# EAGLE design HVPulser0_1 (EAGLE 8.2.2)
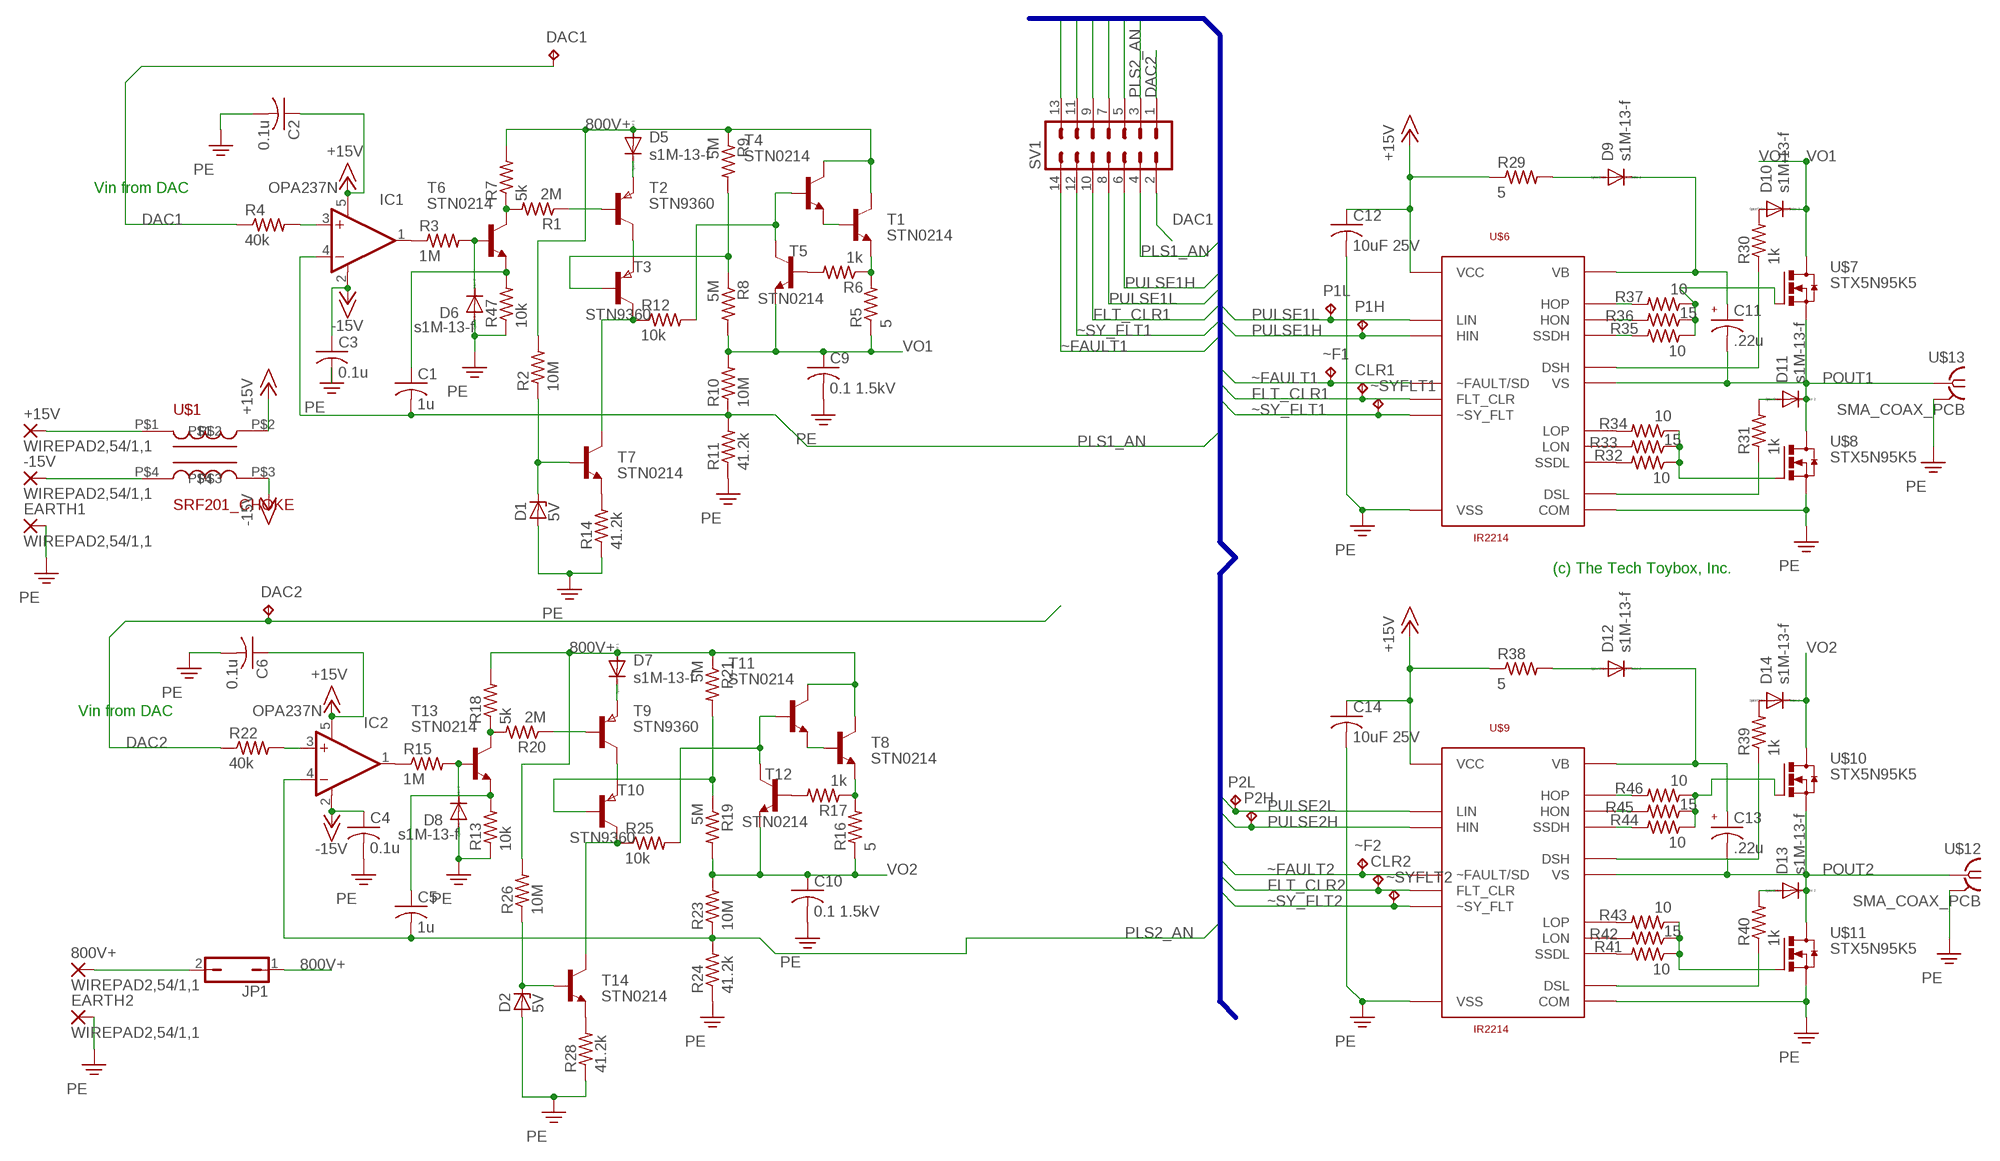
[diagram p0: schematic, sheet 1]

## Parts
800V+  WIREPAD2,54/1,1  [2,54/1,1]
+15V  WIREPAD2,54/1,1  [2,54/1,1]
-15V  WIREPAD2,54/1,1  [2,54/1,1]
C1  1u  C-USC0805  [C0805]
C2  0.1u  C-USC0805  [C0805]
C3  0.1u  C-USC0805  [C0805]
C4  0.1u  C-USC0805  [C0805]
C5  1u  C-USC0805  [C0805]
C6  0.1u  C-USC0805  [C0805]
C9  0.1 1.5kV  C-USC2225K  [C2225K]
C10  0.1 1.5kV  C-USC2225K  [C2225K]
C11  .22u  C-US050-035X075  [C050-035X075]
C12  10uF 25V  C-USC0805  [C0805]
C13  .22u  C-US050-035X075  [C050-035X075]
C14  10uF 25V  C-USC0805  [C0805]
CLR1  TPTP10R  [TP10R]
CLR2  TPTP10R  [TP10R]
D1  5V  ZENER-DIODEDO41Z10  [DO41Z10]
D2  5V  ZENER-DIODEDO41Z10  [DO41Z10]
D5  s1M-13-f  DIODE-DO214AC  [DO214AC]
D6  s1M-13-f  DIODE-DO214AC  [DO214AC]
D7  s1M-13-f  DIODE-DO214AC  [DO214AC]
D8  s1M-13-f  DIODE-DO214AC  [DO214AC]
D9  s1M-13-f  DIODE-DO214AC  [DO214AC]
D10  s1M-13-f  DIODE-DO214AC  [DO214AC]
D11  s1M-13-f  DIODE-DO214AC  [DO214AC]
D12  s1M-13-f  DIODE-DO214AC  [DO214AC]
D13  s1M-13-f  DIODE-DO214AC  [DO214AC]
D14  s1M-13-f  DIODE-DO214AC  [DO214AC]
DAC1  TPTP10R  [TP10R]
DAC2  TPTP10R  [TP10R]
EARTH1  WIREPAD2,54/1,1  [2,54/1,1]
EARTH2  WIREPAD2,54/1,1  [2,54/1,1]
IC1  OPA237N  [SOT23-5]
IC2  OPA237N  [SOT23-5]
JP1  JP1Q  [JP1]
P1H  TPTP10R  [TP10R]
P1L  TPTP10R  [TP10R]
P2H  TPTP10R  [TP10R]
P2L  TPTP10R  [TP10R]
R1  2M  R-US_0613/15  [P0613/15]
R2  10M  R-US_0613/15  [P0613/15]
R3  1M  R-US_R0603  [R0603]
R4  40k  R-US_R0603  [R0603]
R5  5  R-US_0613/15  [P0613/15]
R6  1k  R-US_0613/15  [P0613/15]
R7  5k  R-US_R0603  [R0603]
R8  5M  R-US_0613/15  [P0613/15]
R9  5M  R-US_0613/15  [P0613/15]
R10  10M  R-US_0613/15  [P0613/15]
R11  41.2k  R-US_0613/15  [P0613/15]
R12  10k  R-US_R0603  [R0603]
R13  10k  R-US_R0805  [R0805]
R14  41.2k  R-US_0613/15  [P0613/15]
R15  1M  R-US_R0603  [R0603]
R16  5  R-US_0613/15  [P0613/15]
R17  1k  R-US_0613/15  [P0613/15]
R18  5k  R-US_R0603  [R0603]
R19  5M  R-US_0613/15  [P0613/15]
R20  2M  R-US_0613/15  [P0613/15]
R21  5M  R-US_0613/15  [P0613/15]
R22  40k  R-US_R0603  [R0603]
R23  10M  R-US_0613/15  [P0613/15]
R24  41.2k  R-US_0613/15  [P0613/15]
R25  10k  R-US_R0603  [R0603]
R26  10M  R-US_0613/15  [P0613/15]
R28  41.2k  R-US_0613/15  [P0613/15]
R29  5  R-US_0207/10  [0207/10]
R30  1k  R-US_R0603  [R0603]
R31  1k  R-US_R0603  [R0603]
R32  10  R-US_R0805  [R0805]
R33  15  R-US_R0805  [R0805]
R34  10  R-US_R0805  [R0805]
R35  10  R-US_R0805  [R0805]
R36  15  R-US_R0805  [R0805]
R37  10  R-US_R0805  [R0805]
R38  5  R-US_0207/10  [0207/10]
R39  1k  R-US_R0603  [R0603]
R40  1k  R-US_R0603  [R0603]
R41  10  R-US_R0805  [R0805]
R42  15  R-US_R0805  [R0805]
R43  10  R-US_R0805  [R0805]
R44  10  R-US_R0805  [R0805]
R45  15  R-US_R0805  [R0805]
R46  10  R-US_R0805  [R0805]
R47  10k  R-US_R0805  [R0805]
SV1  MA07-2  [MA07-2]
T1  STN0214  -NPN-SOT223  [SOT223]
T2  STN9360  PNPSOT223  [SOT223]
T3  STN9360  PNPSOT223  [SOT223]
T4  STN0214  -NPN-SOT223  [SOT223]
T5  STN0214  -NPN-SOT223  [SOT223]
T6  STN0214  -NPN-SOT223  [SOT223]
T7  STN0214  -NPN-SOT223  [SOT223]
T8  STN0214  -NPN-SOT223  [SOT223]
T9  STN9360  PNPSOT223  [SOT223]
T10  STN9360  PNPSOT223  [SOT223]
T11  STN0214  -NPN-SOT223  [SOT223]
T12  STN0214  -NPN-SOT223  [SOT223]
T13  STN0214  -NPN-SOT223  [SOT223]
T14  STN0214  -NPN-SOT223  [SOT223]
U$1  SRF201_CHOKE  [CHOKE_BOURNES_SRF2012]
U$6  IR2214  [SSOP24-IR-0.65]
U$7  STX5N95K5  [TO220AV]
U$8  STX5N95K5  [TO220AV]
U$9  IR2214  [SSOP24-IR-0.65]
U$10  STX5N95K5  [TO220AV]
U$11  STX5N95K5  [TO220AV]
U$12  SMA_COAX_PCB  [SMA-COAX-V-TECONNECT]
U$13  SMA_COAX_PCB  [SMA-COAX-V-TECONNECT]
~F1  TPTP10R  [TP10R]
~F2  TPTP10R  [TP10R]
~SYFLT1  TPTP10R  [TP10R]
~SYFLT2  TPTP10R  [TP10R]

## Nets
800V+: D5.A D7.A JP1.1 R2.2 R7.2 R9.1 R18.2 R21.1 R26.2 T1.4(C) T4.4(C) T8.4(C) T11.4(C)
+15V: C2.1 C6.1 C12.1 C14.1 IC1.5(V+) IC2.5(V+) R29.1 R38.1 U$1.P$2 U$6.P$11(VCC) U$9.P$11(VCC)
+800VIN: 800V+.1(P) JP1.2
-15V: C3.1 C4.1 IC1.2(V-) IC2.2(V-) U$1.P$3
DAC1: DAC1.TP R4.1 SV1.2
DAC2: DAC2.TP R22.1 SV1.1
FLT_CLR1: CLR1.TP SV1.10 U$6.P$3(FLT_CLR)
FLT_CLR2: CLR2.TP SV1.9 U$9.P$3(FLT_CLR)
N$1: -15V.1(P) U$1.P$4
N$2: +15V.1(P) U$1.P$1
N$3: C1.1 R47.2 T6.3(E)
N$4: C5.1 R13.2 T13.3(E)
N$11: D9.A R29.2
N$12: R31.1 U$6.P$12(DSL)
N$13: D11.A R31.2
N$14: R32.1 R33.1 R34.1 U$8.1(G)
N$15: R35.1 R36.1 R37.1 U$7.1(G)
N$16: R30.1 U$6.P$24(DSH)
N$17: D10.A R30.2
N$18: D12.A R38.2
N$19: R41.2 U$9.P$7(SSDL)
N$20: R42.2 U$9.P$9(LON)
N$21: R43.2 U$9.P$10(LOP)
N$22: IC1.1(OUT) R3.1
N$23: T2.2(C) T2.4(C) T3.3(E)
N$24: R1.1 T2.1(B)
N$25: D5.C T2.3(E)
N$26: D6.C R3.2 T6.1(B)
N$27: IC1.3(+IN) R4.2
N$28: R40.1 U$9.P$12(DSL)
N$29: R5.2 R6.1 T1.3(E)
N$30: T1.1(B) T4.3(E)
N$31: R12.2 T4.1(B) T5.4(C)
N$32: R6.2 T5.1(B)
N$33: R8.1 R9.2 T3.1(B)
N$34: R1.2 R7.1 T6.4(C)
N$35: R12.1 T3.2(C) T3.4(C) T7.4(C)
N$36: R14.2 T7.3(E)
N$37: IC2.1(OUT) R15.1
N$38: D1.C R2.1 T7.1(B)
N$39: T9.2(C) T9.4(C) T10.3(E)
N$40: R16.2 R17.1 T8.3(E)
N$41: T8.1(B) T11.3(E)
N$42: R17.2 T12.1(B)
N$43: R19.1 R21.2 T10.1(B)
N$44: R20.1 T9.1(B)
N$45: D7.C T9.3(E)
N$46: R25.2 T11.1(B) T12.4(C)
N$47: D8.C R15.2 T13.1(B)
N$48: R18.1 R20.2 T13.4(C)
N$49: D13.A R40.2
N$50: IC2.3(+IN) R22.2
N$51: R25.1 T10.2(C) T10.4(C) T14.4(C)
N$52: R28.2 T14.3(E)
N$53: D2.C R26.1 T14.1(B)
N$54: R32.2 U$6.P$7(SSDL)
N$56: R33.2 U$6.P$9(LON)
N$58: R34.2 U$6.P$10(LOP)
N$64: R41.1 R42.1 R43.1 U$11.1(G)
N$69: R44.1 R45.1 R46.1 U$10.1(G)
N$82: R39.1 U$9.P$24(DSH)
N$83: D14.A R39.2
N$84: R46.2 U$9.P$21(HOP)
N$85: R45.2 U$9.P$20(HON)
N$87: R44.2 U$9.P$18(SSDH)
N$88: R37.2 U$6.P$21(HOP)
N$89: R36.2 U$6.P$20(HON)
N$90: R35.2 U$6.P$18(SSDH)
PE: C2.2 C3.2 C4.2 C6.2 C9.2 C10.2 C12.2 C14.2 D1.A D2.A D6.A D8.A EARTH1.1(P) EARTH2.1(P) R11.1 R13.1 R14.1 R24.1 R28.1 R47.1 U$6.P$6(VSS) U$6.P$8(COM) U$8.3(S) U$9.P$6(VSS) U$9.P$8(COM) U$11.3(S) U$12.2 U$12.3 U$12.4 U$12.5 U$13.2 U$13.3 U$13.4 U$13.5
PLS1_AN: C1.2 IC1.4(-IN) R10.1 R11.2 SV1.4
PLS2_AN: C5.2 IC2.4(-IN) R23.1 R24.2 SV1.3
POUT1: C11.2 D11.C U$6.P$19(VS) U$7.3(S) U$8.2(D) U$13.1
POUT2: C13.2 D13.C U$9.P$19(VS) U$10.3(S) U$11.2(D) U$12.1
PULSE1H: P1H.TP SV1.6 U$6.P$1(HIN)
PULSE1L: P1L.TP SV1.8 U$6.P$2(LIN)
PULSE2H: P2H.TP SV1.13 U$9.P$1(HIN)
PULSE2L: P2L.TP SV1.11 U$9.P$2(LIN)
VB3: C11.1 D9.C U$6.P$23(VB)
VB4: C13.1 D12.C U$9.P$23(VB)
VO1: C9.1 D10.C R5.1 R8.2 R10.2 T5.3(E) U$7.2(D)
VO2: C10.1 D14.C R16.1 R19.2 R23.2 T12.3(E) U$10.2(D)
~FAULT1: SV1.14 U$6.P$5(~FAULT/SD) ~F1.TP
~FAULT2: SV1.5 U$9.P$5(~FAULT/SD) ~F2.TP
~SY_FLT1: SV1.12 U$6.P$4(~SY_FLT) ~SYFLT1.TP
~SY_FLT2: SV1.7 U$9.P$4(~SY_FLT) ~SYFLT2.TP

## Buses
PULSE1H,PULSE1L,~FAULT1,~SY_FLT1,FLT_CLR1,PLS1_AN,PULSE2H,PULSE2L,~FAULT2,~SY_FLT2,FLT_CLR2,PLS2_AN,SCL,SDA,*LDAC1,RDY1,DBD_EN,DBD_PULSE,DBD_AN,MCLR,PGED,PGEC,USB_N,USB_P,VBUS,BUSB3V3,USBID,U2TX,U2RX,DET_PULSE,SD_WP,SD_CS,SD_SDI1,SD_SDO1,SD_SCK1,SD_CD,VDD,VSS

## Notes on the sheet
- Vin from DAC
- (c) The Tech Toybox, Inc.
- Vin from DAC

## Library data of the parts
800V+ +15V -15V EARTH1 EARTH2 = wirepad:WIREPAD: Wire PAD connect wire on PCB
C1-C6 C9 C10 C12 C14 = rcl:C-US: CAPACITOR, American symbol
C11 C13 = UserMark:C-US: CAPACITOR, American symbol; PARTNO: C1608X7R1H224K080AB
CLR1 CLR2 DAC1 DAC2 P1H P1L P2H P2L ~F1 ~F2 ~SYFLT1 ~SYFLT2 = testpad:TP: Test pad
D1 D2 = diode:ZENER-DIODE: Z-Diode
D5-D14 = diode:DIODE-: DIODE
IC1 IC2 = burr-brown:OPA237: Operational Amplifiers Single-Supply, MicroAmplifier(TM) Series; MF: TEXAS INSTRUMENTS; MPN: OPA237NA/250; OC_FARNELL: 4625298; OC_NEWARK: 35C1874
JP1 = jumper:JP1Q: JUMPER
R1-R26 R28-R47 = rcl:R-US_: RESISTOR, American symbol
SV1 = UserMark:MA07-2: PIN HEADER; OC_FARNELL: unknown; OC_NEWARK: unknown
T1 T4-T8 T11-T14 = transistor-neu-to92:*-NPN-: NPN Transistror
T2 T3 T9 T10 = zetex:PNPSOT223: PNP TRANSISTOR; MPN: DJT4030P-13; OC_FARNELL: 1710675; OC_NEWARK: 25R4489
U$1 = UserMark:SRF201_CHOKE
U$6 U$9 = UserMark:IR2214
U$7 U$8 U$10 U$11 = UserMark:STX5N95K5
U$12 U$13 = UserMark:SMA_COAX_PCB

## Board
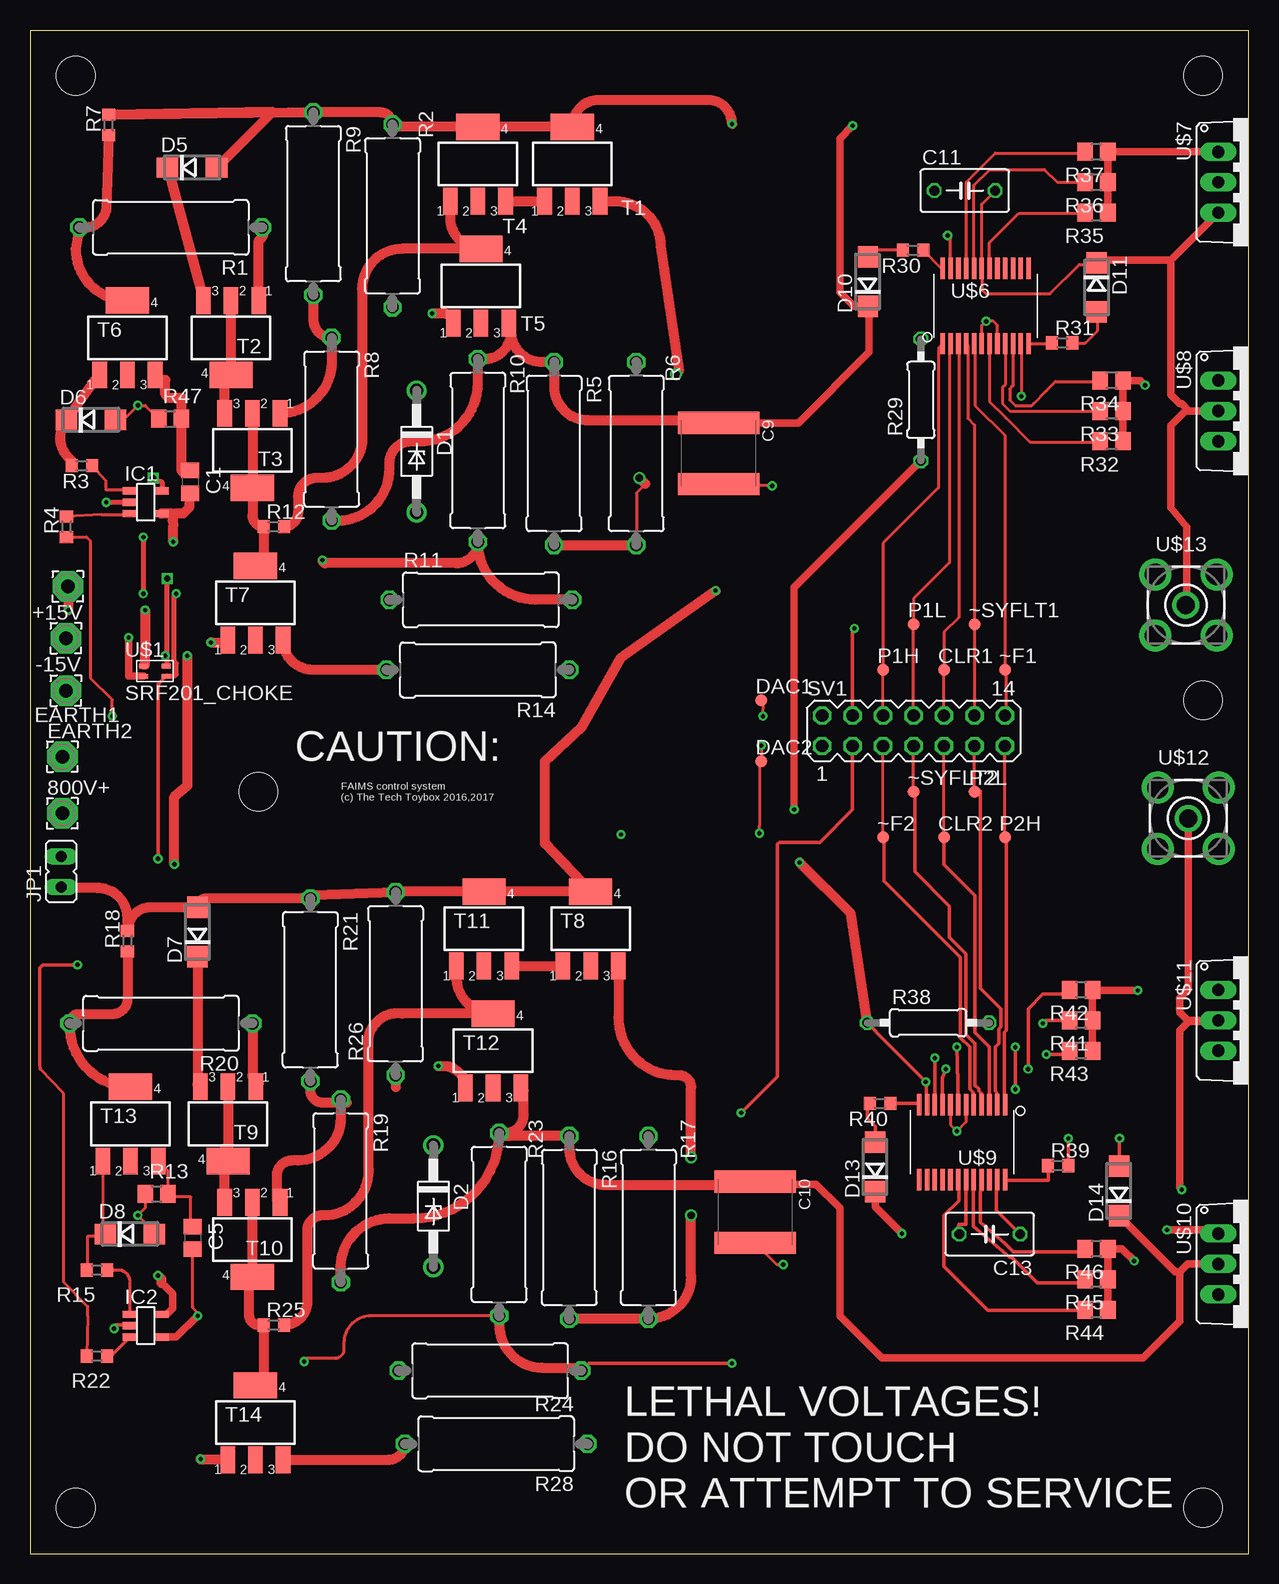
[diagram p1: board, top side]
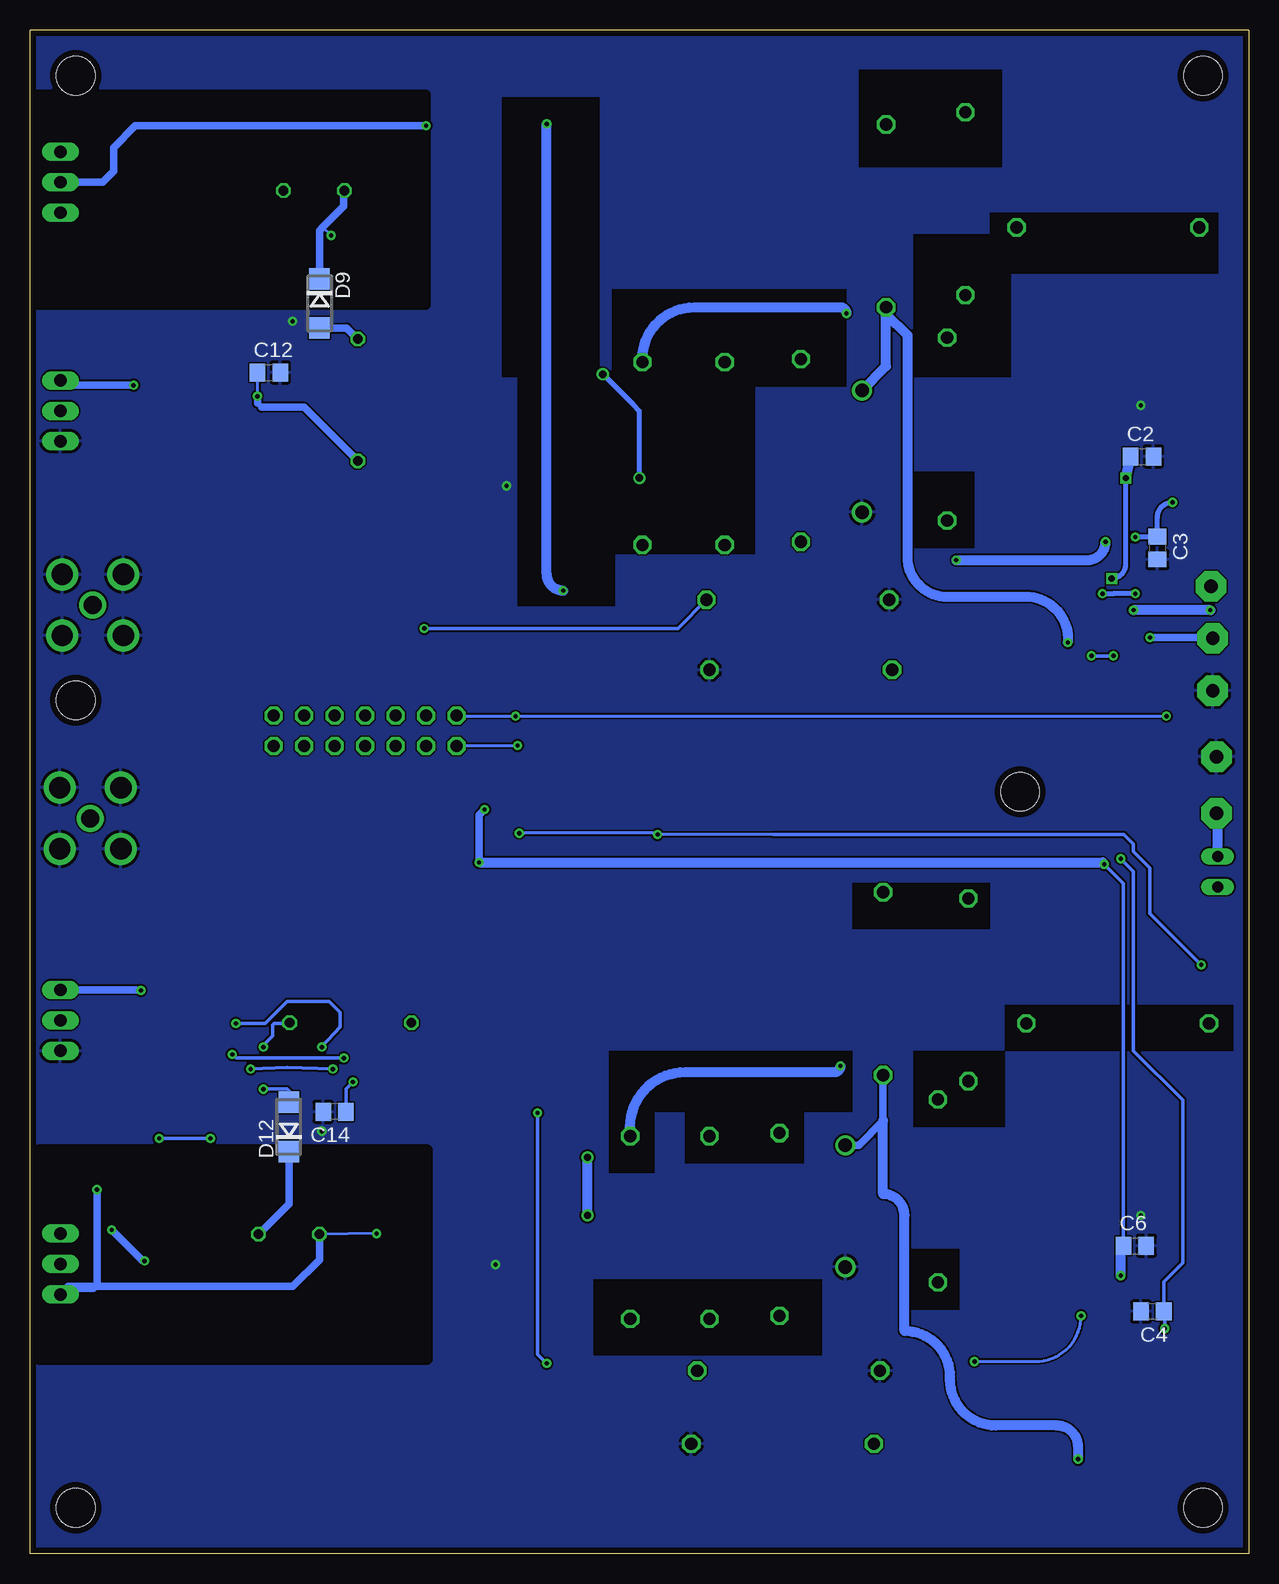
[diagram p2: board, bottom side, seen from below]

Size 101.6 x 127 mm. Coordinates in mm from the lower left corner, seen from the top.
Outline: 0,0 101.6,0 101.6,127 0,127 0,0
Copper layers (1*16): Top 0.0178mm / dielectric 59mil / Bottom 0.0178mm
Design rules "SSC-EAGLE-2Lyr_v1.0.0.3": minimum track width 6mil, minimum drill 14mil, track to track 6mil, track to pad 6mil, pad to pad 6mil, via to via 6mil, smd to smd 6mil, copper to edge 20mil, drill to drill 16mil, minimum pad ring 8mil, minimum via ring 8mil, stop-mask expansion 3mil, vias tented up to drill 0mil, thermal gap 10mil
Holes 3.2 mm at 3.81,123.19 3.81,3.81 97.79,123.19 97.79,3.81 97.79,71.12 19.05,63.5
bRestrict: area 20.6,115.6 to 32.5,123.7; area 37.1,32.5 to 47,36.8; area 68.4,16.2 to 100.9,33.7; area 68.6,104.1 to 101,121.6; area 19.8,98 to 27.9,110; area 54.1,109.5 to 62.2,121.4; area 54.1,98 to 62.2,110; area 52.8,86.6 to 61,98.6; area 52.8,79 to 61,90.9; area 41.1,83.3 to 53.1,91.4; area 41.1,90.9 to 53.1,99.1; area 41.1,97.3 to 53.1,105.4; 11 more areas

### Footprints (pad centres in the part's own frame; a part is rotated, then mirrored left to right if it is on the bottom)
2,54/1,1 = drill 1.118 pad 2.54 octagon: 1 0,0
C0805 = smd 1.3 x 1.5: 1 -0.95,0; 2 0.95,0
C2225K = smd 1.85 x 6.8: 1 -2.55,0; 2 2.55,0
C050-035X075 = drill 0.813 octagon: 1 -2.54,0; 2 2.54,0
TP10R = smd 1 x 1: TP 0,0
DO41Z10 = drill 1.118: A 5.08,0; C -5.08,0
DO214AC = smd 1.8 x 1.7: A 2.05,0; C -2.05,0
SOT23-5 = smd 0.6 x 1.2: 1 -0.95,-1.306; 2 0,-1.306; 3 0.95,-1.306; 4 0.95,1.306; 5 -0.95,1.306
JP1 = drill 0.914 long: 1 0,-1.27; 2 0,1.27
P0613/15 = drill 1.016 octagon: 1 -7.62,0; 2 7.62,0
R0603 = smd 1 x 1.1: 1 -0.85,0; 2 0.85,0
R0805 = smd 1.3 x 1.5: 1 -0.95,0; 2 0.95,0
0207/10 = drill 0.813 octagon: 1 -5.08,0; 2 5.08,0
MA07-2 = drill 1.016 octagon: 1 -7.62,-1.27; 2 -7.62,1.27; 3 -5.08,-1.27; 4 -5.08,1.27; 5 -2.54,-1.27; 6 -2.54,1.27; 7 0,-1.27; 8 0,1.27; 9 2.54,-1.27; 10 2.54,1.27; 11 5.08,-1.27; 12 5.08,1.27; 13 7.62,-1.27; 14 7.62,1.27
SOT223 = smd 1.219 x 2.235: 1 -2.311,-3.099; 2 0,-3.099; 3 2.311,-3.099 | smd 3.6 x 2.2: 4 0,3.099
CHOKE_BOURNES_SRF2012 = smd 0.749 x 0.394: P$1 -0.922,0.427; P$2 0.922,0.427; P$3 0.922,-0.427; P$4 -0.922,-0.427
SSOP24-IR-0.65 = smd 0.381 x 1.78: P$1 0,-3.135; P$2 0.65,-3.135; P$3 1.3,-3.135; P$4 1.95,-3.135; P$5 2.6,-3.135; P$6 3.25,-3.135; P$7 3.9,-3.135; P$8 4.55,-3.135; P$9 5.2,-3.135; P$10 5.85,-3.135; P$11 6.5,-3.135; P$12 7.15,-3.135; P$13 7.15,3.135; P$14 6.5,3.135; P$15 5.85,3.135; P$16 5.2,3.135; P$17 4.55,3.135; P$18 3.9,3.135; P$19 3.25,3.135; P$20 2.6,3.135; P$21 1.95,3.135; P$22 1.3,3.135; P$23 0.65,3.135; P$24 0,3.135
TO220AV = drill 1.016 long: 1 -2.54,-2.54; 2 0,-2.54; 3 2.54,-2.54
SMA-COAX-V-TECONNECT = drill 1.499: 1 0,0 | drill 1.778: 2 -2.55,2.55; 3 2.55,2.55; 4 2.55,-2.55; 5 -2.55,-2.55

### Placement (x,y rotation side)
800V+  2.69,61.7 0 top
+15V  3.15,80.62 180 top
-15V  3,76.3 180 top
C1  13.36,89.33 270 top
C2  8.89,91.44 0 bottom
C3  7.62,83.82 270 bottom
C4  8.03,20.17 180 bottom
C5  13.56,26.31 270 top
C6  9.5,25.65 0 bottom
C9  57.4,91.69 270 top
C10  60.45,28.45 270 top
C11  77.93,113.61 0 top
C12  81.69,98.45 0 bottom
C13  80.01,26.62 180 top
C14  76.2,36.83 180 bottom
CLR1  76.2,73.66 0 top
CLR2  76.2,59.69 0 top
D1  32.23,91.87 270 top
D2  33.63,28.96 270 top
D5  13.51,115.52 0 top
D6  5.08,94.49 0 top
D7  13.97,51.82 90 top
D8  8.33,26.62 0 top
D9  77.47,104.22 270 bottom
D10  69.85,106.02 90 top
D11  88.9,105.54 270 top
D12  80.01,35.56 90 bottom
D13  70.46,32.23 90 top
D14  90.78,30.23 90 top
DAC1  60.96,71.12 0 top
DAC2  60.96,66.04 0 top
EARTH1  3,71.93 180 top
EARTH2  2.69,66.42 0 top
IC1  9.65,87.63 270 top
IC2  9.65,19 270 top
JP1  2.59,56.85 0 top
P1H  71.12,73.66 0 top
P1L  73.66,77.47 0 top
P2H  81.28,59.69 0 top
P2L  78.74,63.5 0 top
R1  11.73,110.54 180 top
R2  30.23,111.51 90 top
R3  4.32,90.68 180 top
R4  3.05,85.6 90 top
R5  43.69,91.69 270 top
R6  50.55,91.69 90 top
R7  6.55,119.08 90 top
R8  25.15,93.73 270 top
R9  23.62,112.52 270 top
R10  37.34,91.95 90 top
R11  37.59,79.5 0 top
R12  20.32,85.6 0 top
R13  10.57,29.97 0 top
R14  37.34,73.66 180 top
R15  5.59,23.62 180 top
R16  44.96,27.18 270 top
R17  51.56,27.18 90 top
R18  8.13,51.05 90 top
R19  25.91,30.23 270 top
R20  10.92,44.2 180 top
R21  23.37,46.99 270 top
R22  5.59,16.46 0 top
R23  39.12,27.43 90 top
R24  38.35,15.24 0 top
R25  20.32,19.05 0 top
R26  30.48,47.5 90 top
R28  38.86,9.14 180 top
R29  74.27,96.16 90 top
R30  73.61,108.64 180 top
R31  86.06,100.91 0 top
R32  90.17,92.71 180 top
R33  90.17,95.25 180 top
R34  90.17,97.79 180 top
R35  88.9,111.76 180 top
R36  88.9,114.3 180 top
R37  88.9,116.84 180 top
R38  74.88,44.25 0 top
R39  85.7,32.33 0 top
R40  70.87,37.52 180 top
R41  87.63,44.45 180 top
R42  87.63,46.99 180 top
R43  87.63,41.91 180 top
R44  88.9,20.32 180 top
R45  88.9,22.86 180 top
R46  88.9,25.4 180 top
R47  11.68,94.59 0 top
SV1  73.66,68.58 0 top
T1  45.21,115.82 0 top
T2  16.76,101.35 180 top
T3  18.54,91.95 180 top
T4  37.34,115.82 0 top
T5  37.59,105.66 0 top
T6  8.13,101.35 0 top
T7  18.8,79.25 0 top
T8  46.74,52.07 0 top
T9  16.51,35.81 180 top
T10  18.54,26.16 180 top
T11  37.85,52.07 0 top
T12  38.61,41.91 0 top
T13  8.38,35.81 0 top
T14  18.8,10.92 0 top
U$1  10.41,73.56 0 top
U$6  76.1,103.99 0 top
U$7  101.6,114.3 270 top
U$8  101.6,95.25 270 top
U$9  81.28,34.29 180 top
U$10  101.6,24.13 270 top
U$11  101.6,44.45 270 top
U$12  96.57,61.29 0 top
U$13  96.37,79.07 0 top
~F1  81.28,73.66 0 top
~F2  71.12,59.69 0 top
~SYFLT1  78.74,77.47 0 top
~SYFLT2  73.66,63.5 0 top

### Tracks (layer width: path | path; a pad name or v marks a point on that pad's centre or on a via)
800V+  (via drill 0.36)
  Top 0.813: T11.4 T8.4 42.93,59.18 42.93,66.04 45.97,68.83 49.28,74.68 v57.15,80.26 | T11.4 37.29,55.17 arc-90 37.08,55.37 arc90 37.34,55.12 37.8,55.12 arc90 T11.4 | T11.4 30.02,55.17 arc90 R26.2 23.62,54.86 arc90 R21.1 14.71,54.61 arc90 D7.A 10.09,53.87 arc90 R18.2 8.13,52.98 arc90 5.64,55.47 2.69,55.47 arc-90 JP1.1 | v58.52,119.18 arc90 56.54,121.16 47.4,121.16 arc90 45.21,118.97 T1.4 38.15,118.92 arc90 38.1,118.87 37.39,118.87 arc-90 T4.4 30.23,118.92 R2.2 arc90 29.21,120.14 R9.1 21.59,120.14 R7.2 20.22,120.17 D5.A
  Bottom 0.813: v57.15,80.26 arc90 58.52,81.64 v58.52,119.18
+15V  (via drill 0.36, 0.51)
  Top 0.254: U$6.P$11 82.64,100.81 v82.64,96.47
  Top 0.305: v11.28,74.83 11.43,74.83 | U$9.P$11 74.73,37.48 74.73,38.91 74.68,38.96 v74.68,39.32 71.32,42.67 R38.1
  Top 0.406: U$1.P$2 arc90 11.43,74.08 11.43,74.83 v11.43,81.28 | v10.26,89.66 10.87,89.36 arc-90 11.02,89.2 11.02,88.65 arc-90 IC1.5
  Top 0.61: R29.1 63.7,80.52 v63.7,62.03 | IC2.5 11.41,19.95 11.89,20.42 11.89,21.64 10.97,22.55
  Top 0.813: v13.11,74.83 13.11,64.01 12.04,63.09 v12.04,57.45 | 10.97,22.55 10.97,22.86 v10.67,23.16 | R38.1 68.43,53.34 v64.16,57.61
  Bottom 0.254: 82.3,95.56 82.64,95.89 | v82.64,96.47 82.64,96.16 v82.64,96.47 | v82.64,96.47 C12.1
  Bottom 0.305: v11.28,74.83 v13.11,74.83 | C6.1 10.45,55.87 v12.04,57.45 | C14.1 75.25,38.74 v74.68,39.32
  Bottom 0.406: v11.43,81.28 arc-90 10.26,82.45 v10.26,89.66
  Bottom 0.61: R29.1 78.74,95.56 82.3,95.56 | 82.64,95.89 82.64,96.16 | v63.7,62.03 64.16,61.57 v64.16,57.61
  Bottom 0.813: v10.26,89.66 C2.1 | v10.67,23.16 10.67,25.44 C6.1 | v64.16,57.61 12.19,57.61 v12.04,57.45
+800VIN
  Bottom 0.813: JP1.2 2.59,61.59 800V+.1
-15V  (via drill 0.36)
  Top 0.305: IC2.2 8.23,19.05 7.16,19.05 7.01,18.9 v7.01,18.75 | v10.67,57.91 10.67,72.46 U$1.P$3
  Top 0.406: v6.35,87.63 IC1.2 | v9.45,84.73 v9.45,80.01 | v12.19,80.01 12.04,79.86 12.04,74.37 12.19,74.22 12.19,73.3 12.04,73.15 11.43,73.15 U$1.P$3
  Bottom 0.305: v7.01,18.75 7.01,20.12 C4.1 7.08,22.64 5.49,24.23 5.49,37.8 9.6,41.91 9.6,56.84 v10.67,57.91
  Bottom 0.406: v6.35,87.63 arc-90 7.62,86.36 C3.1 7.77,84.73 v9.45,84.73 | v9.45,80.01 11.28,80.01 v12.19,80.01
DAC1  (via drill 0.36)
  Top 0.254: v6.86,69.8 6.86,71.17 5.03,73 5.03,84.43 4.72,84.73 3.05,84.73 R4.1 | DAC1.TP 60.96,71.17 61.11,71.17 61.11,70.41 v61.11,69.8
  Bottom 0.254: v6.86,69.8 v61.11,69.8 65.99,69.8 SV1.2
DAC2  (via drill 0.36)
  Top 0.254: R22.1 4.83,19.81 4.83,20.57 2.79,22.61 2.79,38.35 0.86,40.39 | v49.28,59.94 49.53,59.94 | v60.96,67.36 60.96,66.14 | 60.96,66.14 DAC2.TP 60.96,66.14 | 60.96,66.14 60.81,65.99 60.81,60.66 v60.81,60.05
  Top 0.305: v3.96,49.07 1.07,49.07 0.81,48.82 0.81,40.74 0.86,40.39
  Bottom 0.254: 39.62,59.94 v49.28,59.94 49.38,60.05 v60.81,60.05 | v60.96,67.36 65.99,67.36 SV1.1
  Bottom 0.305: 39.62,59.94 10.41,59.94 9.6,59.13 9.6,58.52 8.23,57.15 8.23,53.34 v3.96,49.07
FLT_CLR1
  Top 0.254: SV1.10 CLR1.TP 76.2,76.81 77.42,78.03 77.42,100.83 U$6.P$3
FLT_CLR2
  Top 0.254: CLR2.TP SV1.9
  Top 0.305: U$9.P$3 79.98,42.24 78.79,43.43 78.79,54.86 76.2,57.45 CLR2.TP
N$1  (via drill 0.36)
  Top 0.61: U$1.P$4 9.45,73.15 8.38,73.15 8.23,73.15 v8.23,76.35
  Bottom 0.61: v8.23,76.35 3.05,76.35 -15V.1
N$2  (via drill 0.36)
  Top 0.61: 9.6,74.07 U$1.P$1
  Top 0.813: 9.6,74.07 9.6,75.44 v9.6,78.64 | v3.2,78.64 3.2,80.62 +15V.1
  Bottom 0.813: v3.2,78.64 v9.6,78.64
N$3
  Top 0.813: C1.1 13.26,90.22 12.65,90.22 12.65,94.49 R47.2 12.65,94.94 12.65,96.32 11.58,96.32 11.28,96.62 11.28,97.84 10.52,97.84 10.52,98.15 T6.3
N$4
  Top 0.254: C5.1 13.56,27.13 13.41,27.28 13.41,29.72 11.77,29.72 R13.2 11.52,31.89 T13.3
N$11
  Bottom 0.61: D9.A 75.19,102.17 R29.2
N$12
  Top 0.254: U$6.P$12 85.14,100.85 R31.1
N$13
  Top 0.254: R31.2 87.96,100.91 89,101.96 89,103.39 D11.A
N$14  (via drill 0.36)
  Top 0.61: R32.1 R33.1 | R33.1 R34.1 | R33.1 R34.1 | R34.1 92.56,97.79 v92.96,97.38
  Bottom 0.61: v92.96,97.38 98.65,97.38 U$8.1
N$15
  Top 0.61: R35.1 R36.1 R37.1 U$7.1
N$16
  Top 0.254: U$6.P$24 75.97,107.12 R30.1
N$17
  Top 0.254: R30.2 70.42,108.64 D10.A
N$18  (via drill 0.36)
  Top 0.305: v82.14,38.71 v82.14,42.22
  Bottom 0.305: v82.14,42.22 82.3,42.22 81.38,43.13 81.38,44.04 81.23,44.2 80.01,44.2 R38.2 | v82.14,38.71 80.16,38.71 80.01,38.56 80.01,37.64 D12.A
N$19  (via drill 0.36)
  Top 0.305: R41.2 84.68,44.45 v84.43,44.2 | v77.27,42.22 77.37,39.27 77.37,38.86 77.37,37.44 U$9.P$7
  Bottom 0.305: v84.43,44.2 81.99,44.2 80.16,46.02 76.66,46.02 75.74,45.11 75.74,43.89 v77.27,42.22
N$20  (via drill 0.36)
  Top 0.305: U$9.P$9 76.08,39.66 v76.35,40.39 | v83.21,40.39 83.21,45.41 84.43,46.63 86.32,46.63 R42.2
  Bottom 0.305: v76.35,40.39 80.16,40.54 v83.21,40.39
N$21  (via drill 0.36)
  Top 0.305: U$9.P$10 v75.43,41.29 v75.44,41.3 | v84.73,41.6 86.38,41.6 R43.2
  Bottom 0.305: v75.44,41.3 84.43,41.3 v84.73,41.6
N$22
  Top 0.254: R3.1 6.35,89.41 6.35,88.65 8.13,88.65 IC1.1
N$23
  Top 0.813: T3.3 16.23,97.71 arc-90 T2.4 T2.2
N$24
  Top 0.813: T2.1 19.07,109.45 arc90 R1.1
N$25
  Top 0.813: D5.C 14.48,104.47 arc-90 T2.3
N$26
  Top 0.813: R3.2 3.47,91.12 arc-90 D6.C 5.57,98 arc-90 T6.1
N$27
  Top 0.254: IC1.3 8.13,86.61 6.35,86.61 5.94,86.61 R4.2
N$28
  Top 0.305: R40.1 74.04,37.52 U$9.P$12
N$29  (via drill 0.6)
  Top 0.254: 51.31,89.15 50.55,88.39 R6.1
  Top 0.813: T1.3 48.82,112.72 arc-90 52.58,108.97 54.1,98.55 v53.85,98.3 | v50.8,89.66 51.31,89.15 | R5.2 R6.1
  Bottom 0.406: v50.8,89.66 50.8,92.46 50.8,93.47 50.8,95.25 51.31,95.76 v53.85,98.3 | v53.85,98.3 52.07,96.52 v53.85,98.3
N$30
  Top 0.813: T4.3 T1.1
N$31
  Top 0.813: T4.1 35.03,111.33 arc90 T5.4 31.04,108.76 arc90 27.69,105.41 27.69,92.96 arc-90 24.38,89.66 23.88,89.66 arc90 22.35,88.14 22.35,86.78 arc-90 R12.2
N$32  (via drill 0.36)
  Top 0.813: v33.53,103.38 34.47,103.38 arc-90 T5.1
  Bottom 0.813: R6.2 50.55,99.57 arc90 46.23,103.89 34.04,103.89 arc90 v33.53,103.38
N$33
  Top 0.813: R9.2 23.62,102.87 arc90 R8.1 25.15,99.34 arc-90 T3.1
N$34
  Top 0.813: R7.1 6.35,112.01 arc-90 R1.2 3.81,108.76 arc90 T6.4
N$35
  Top 0.813: T3.2 T3.4 18.54,86.53 arc90 R12.1 19.47,83.02 arc-90 T7.4
N$36
  Top 0.813: R14.2 23.6,73.66 arc-90 T7.3
N$37
  Top 0.254: IC2.1 8.35,22.64 arc90 7.37,23.62 R15.1
N$38  (via drill 0.36)
  Top 0.813: v15.09,75.95 16.28,75.95 arc90 T7.1
  Bottom 0.813: v15.09,75.95 arc-90 18.29,79.76 25.15,79.76 arc90 28.45,83.06 28.45,84.07 28.45,98.55 28.45,101.55 30.23,103.33 | D1.C 30.23,98.96 30.23,103.33 | 30.23,103.33 R2.1
N$39
  Top 0.813: T10.3 16.23,33.27 | 16.23,33.27 16.23,33.76 arc-90 16.26,33.78 16.26,33.53 arc90 16.51,33.27 T9.4 | T9.2 16.51,33.55 arc-90 16.23,33.27
N$40  (via drill 0.6)
  Top 0.813: T8.3 49.05,44.68 arc90 53.85,39.88 54.1,39.88 arc-90 55.12,38.86 v55.12,33.02 | R16.2 R17.1 arc90 55.12,23.11 v55.12,28.19
  Bottom 0.813: v55.12,28.19 v55.12,33.02
N$41
  Top 0.813: T11.3 T8.1
N$42  (via drill 0.36)
  Top 0.813: v34.04,40.64 34.47,40.64 arc-90 T12.1
  Bottom 0.813: R17.2 51.56,35.56 arc90 46.99,40.13 34.54,40.13 arc-90 v34.04,40.64
N$43
  Top 0.813: R21.2 23.37,38.61 arc90 24.38,37.59 26.42,37.59 26.16,37.59 arc-90 R19.1 25.91,36.32 arc-90 22.35,32.77 21.84,32.77 arc90 20.57,31.5 20.57,29.54 arc90 T10.1
N$44
  Top 0.813: R20.1 18.54,39.88 arc90 19.05,39.37 19.05,39.14 arc-90 T9.1
N$45
  Top 0.813: D7.C 13.97,39.14 arc90 T9.3
N$46
  Top 0.813: T11.1 35.53,48.08 arc90 T12.4 31.04,45.01 arc90 28.19,42.93 28.19,32.26 arc-90 24.89,28.19 24.38,28.19 arc90 23.11,26.92 23.11,20.99 arc-90 R25.2
N$47
  Top 0.254: 6.1,26.47 4.83,26.47 4.83,23.62 R15.2 | 6.1,26.47 6.5,26.47 | 6.5,26.47 D8.C 6.5,26.47 | 6.1,26.47 6.1,32.51 T13.1 | 6.1,26.47 6.5,26.47
N$48
  Top 0.813: R18.1 8.13,46.23 arc-90 6.86,44.96 4.06,44.96 arc90 R20.2 3.3,43.99 arc90 T13.4
N$49
  Top 0.305: D13.A 70.46,35.61 69.8,36.27 69.8,37.3 R40.2
N$50
  Top 0.305: R22.2 6.76,16.46 IC2.3
N$51
  Top 0.813: T14.4 arc90 19.47,14.7 R25.1 19.05,19.05 arc-90 18.29,19.81 18.29,22.81 arc-90 T10.4 T10.2
N$52
  Top 0.813: T14.3 29.92,7.82 arc90 R28.2
N$53  (via drill 0.36)
  Top 0.813: R26.1 30.48,38.86 | T14.1 14.28,7.82 arc-90 v14.22,7.87
  Bottom 0.61: D2.C 32.51,34.04 30.48,36.07 R26.1
  Bottom 0.813: v14.22,7.87 14.22,8.89 arc-90 16,10.67 21.08,10.67 arc90 24.89,14.48 24.89,14.73 arc-90 28.7,18.54 28.7,28.19 arc-90 30.48,29.97 30.48,36.07
N$54
  Top 0.254: U$6.P$7 80,96.02 81.23,94.79 81.38,94.64 83.36,92.66 89.17,92.66 R32.2
N$56
  Top 0.254: U$6.P$9 81.3,97.45 81.08,97.23 81.08,95.86 81.69,95.25 R33.2
N$58
  Top 0.254: U$6.P$10 81.95,97.34 81.69,97.08 81.69,96.16 82.14,95.71 83.52,95.71 83.67,95.86 84.73,96.93 85.5,97.69 89.12,97.69 R34.2
N$64  (via drill 0.36)
  Top 0.61: R43.1 R41.1 R42.1 88.63,46.94 v92.35,46.94
  Bottom 0.61: v92.35,46.94 92.41,46.99 U$11.1
N$69  (via drill 0.36)
  Top 0.61: U$10.1 98.75,26.98 v94.79,26.98 | v92.05,24.38 91.03,25.4 R46.1 R45.1 R44.1
  Bottom 0.61: v94.79,26.98 92.2,24.38 v92.05,24.38
N$82
  Top 0.305: U$9.P$24 81.38,31.09 83.97,31.09 84.89,31.09 84.89,32.31 R39.1
N$83  (via drill 0.36)
  Top 0.305: v90.83,34.59 90.83,32.31 D14.A | v86.56,34.59 86.56,32.46 R39.2
  Bottom 0.305: v86.56,34.59 v90.83,34.59
N$84
  Top 0.305: U$9.P$21 79.4,31.09 79.4,30.33 79.25,30.18 79.25,27.58 81.23,25.91 81.99,25.15 87.94,25.15 87.94,25.3 R46.2
N$85
  Top 0.305: U$9.P$20 78.64,31.09 78.64,30.33 78.64,30.02 78.64,29.87 78.64,29.72 78.64,27.28 81.69,24.69 81.84,24.69 83.97,22.55 87.94,22.55 87.94,22.86 R45.2
N$87
  Top 0.305: U$9.P$18 77.42,31.09 77.42,29.41 76.2,28.19 76.2,23.93 76.5,23.62 79.25,20.88 79.86,20.27 | 79.86,20.27 80.01,20.27 | 79.86,20.27 80.01,20.27 | 80.01,20.27 83.06,20.27 83.21,20.27 86.26,20.27 87.94,20.27 R44.2 | 80.01,20.27 79.86,20.27
N$88
  Top 0.254: U$6.P$21 78.05,114.32 80.47,116.74 87.85,116.74 R37.2
N$89
  Top 0.254: U$6.P$20 78.7,114.06 80.01,115.37 84.58,115.37 85.65,114.3 R36.2
N$90
  Top 0.254: U$6.P$18 80,109.26 82.45,111.71 87.9,111.71 R35.2
PE  (via drill 0.36)
  Top 0.254: D6.A 7.77,94.49 v8.99,95.71 9.62,95.71 R47.1 | v61.87,89 57.55,89 C9.2 | D8.A 10.38,26.8 v8.99,28.19 9.62,28.82 R13.1 | v62.79,24.08 62.27,24.08 C10.2 | U$9.P$8 76.73,35.74 v77.27,35.2 78.03,35.97 U$9.P$6 | U$6.P$6 79.35,102.36 v79.7,102.72 80.31,102.72 80.65,102.38 U$6.P$8
  pour Bottom: -3.96,131.06 106.98,131.06 106.98,78.18 106.98,-10.52 -6.55,-10.52 -6.55,130.15
PLS1_AN  (via drill 0.36)
  Top 0.305: v68.73,77.11 68.58,76.96 SV1.4
  Top 0.813: R11.2 42.16,79.5 arc-90 R10.1 arc-90 35.56,82.55 24.64,82.55 arc-90 v24.38,82.8 | v11.94,84.33 11.94,85.7 11.89,86.11 11.89,86.56 | 11.89,86.56 11.73,86.72 10.97,86.72 IC1.4 | 11.89,86.56 12.19,86.72 12.8,86.72 13.26,87.17 13.26,88.24 C1.2
  Bottom 0.305: R11.2 47.6,77.11 v68.73,77.11
  Bottom 0.813: v24.38,82.8 13.46,82.8 arc-90 v11.94,84.33
PLS2_AN  (via drill 0.36)
  Top 0.254: R23.1 28.45,19.81 arc90 26.16,17.53 26.16,17.02 arc-90 25.4,16.26 23.11,16.26 arc90 v22.86,16 | C5.2 13.56,25.3 13.56,20.57 13.53,20.5 13.97,20.06 v13.97,19.81
  Top 0.305: SV1.3 68.58,62.03 65.84,59.28 62.48,59.28 62.33,59.13 62.33,39.78 v59.28,36.73 | v58.52,15.85 46.58,15.85 R24.2
  Top 0.61: IC2.4 12.21,18.05 v13.97,19.81
  Top 0.813: R23.1 39.12,19.05 arc90 42.67,15.49 45.72,15.49 arc-90 R24.2
  Bottom 0.254: v22.86,16 17.78,16 arc-90 v13.97,19.81
  Bottom 0.305: v59.28,36.73 59.28,16.61 v58.52,15.85
POUT1
  Top 0.254: C11.2 79.35,112.5 U$6.P$19 79.35,105.36 79.7,105 85.04,105 87.48,107.44 88.75,107.44 D11.C
  Top 0.61: U$13.1 96.42,79.83 96.42,85.55 95.1,87.17 95.1,94.03 96.32,95.25 U$8.2 96.62,95.25 96.01,95.86 95.86,95.86 95.1,96.62 95.1,107.8 | 95.1,107.8 U$7.3 | 95.1,107.8 89.11,107.8 D11.C
POUT2  (via drill 0.36)
  Top 0.305: C13.2 77.42,26.67 77.42,27.43 78.03,27.43 78.03,31.09 U$9.P$19
  Top 0.61: v72.69,26.67 70.46,28.91 D13.C | v96.01,30.33 95.86,30.48 95.86,43.59 96.62,44.35 | 96.62,44.35 96.72,44.45 U$11.2 98.96,44.35 96.62,44.35 | 96.62,44.35 95.86,45.11 95.86,46.33 96.57,47.04 U$12.1
  Bottom 0.254: v72.69,26.67 C13.2
  Bottom 0.61: U$10.3 98.4,22.25 | 98.4,22.25 79.7,22.25 77.47,24.49 C13.2 | 98.4,22.25 98.25,22.1 96.32,22.1 96.01,22.4 v96.01,30.33
PULSE1H
  Top 0.254: SV1.6 P1H.TP 71.12,84.23 75.74,88.85 75.74,100.5 U$6.P$1
PULSE1L
  Top 0.254: SV1.8 P1L.TP 73.66,79.6 76.66,82.6 76.66,100.76 U$6.P$2
PULSE2H
  Top 0.254: P2H.TP SV1.13
  Top 0.305: P2H.TP 81.38,59.59 81.38,43.59 81.23,43.43 81.23,37.49 U$9.P$1
PULSE2L
  Top 0.254: 78.79,63.55 78.74,63.6 SV1.11
  Top 0.305: U$9.P$2 80.62,37.49 80.62,38.41 80.47,38.56 80.47,42.22 80.77,42.52 80.77,43.74 80.92,43.89 80.92,45.41 79.25,47.09 79.25,63.55 78.79,63.55 P2L.TP
VB3  (via drill 0.36)
  Top 0.254: U$6.P$23 76.75,109.64 v76.5,109.88
  Bottom 0.254: v76.5,109.88 77.19,110.57
  Bottom 0.61: D9.C 77.47,110.29 77.19,110.57 75.44,112.32 75.44,113.56 C11.1
VB4
  Top 0.305: U$9.P$23 80.57,31.09 80.57,28.6 C13.1
  Bottom 0.61: C13.1 80.01,29.16 D12.C
VO1  (via drill 0.36)
  Top 0.61: C9.1 64.07,94.24 69.95,100.13 69.95,103.87 D10.C 68.7,103.97 67.51,105.16 67.51,117.96 v68.58,119.02
  Top 0.813: R8.2 25.65,86.11 arc90 29.97,90.42 29.97,90.93 arc-90 31.75,92.71 32.51,92.71 arc90 37.34,97.54 R10.2 37.85,99.57 arc90 40.13,101.85 | 40.13,101.85 40.13,102.34 arc90 T5.3 | 40.13,101.85 arc90 42.67,99.31 R5.1 43.69,97.28 arc90 46.48,94.49 57.16,94.49 arc-90 C9.1
  Bottom 0.61: v68.58,119.02 92.81,119.02 94.64,117.2 94.64,115.21 95.56,114.3 U$7.2
VO2
  Top 0.61: C10.1 60.66,30.79 65.53,30.79 67.51,28.8 67.51,19.81 71.02,16.31 92.81,16.31 95.86,19.36 95.86,23.47 | 95.86,23.47 96.52,24.13 U$10.2 | D14.C 95.49,23.47 95.86,23.47
  Top 0.813: R19.2 25.91,23.88 arc-90 29.97,27.94 32,27.94 arc90 R23.2 39.62,35.05 | 39.62,35.05 arc90 41.15,36.58 41.15,38.58 arc90 T12.3 | C10.1 arc-90 60.19,30.73 48.01,30.73 arc-90 44.96,33.78 R16.1 39.88,34.8 arc-90 39.62,35.05
~FAULT1
  Top 0.254: SV1.14 81.38,69.95 81.38,73.15 81.28,73.25 ~F1.TP 81.28,93.22 78.79,95.71 78.79,100.76 U$6.P$5
~FAULT2
  Top 0.254: ~F2.TP SV1.5
  Top 0.305: U$9.P$5 78.64,37.49 78.64,38.41 78.33,38.71 78.33,42.22 77.57,42.98 77.57,49.68 71.17,56.08 71.17,59.64 ~F2.TP
~SY_FLT1
  Top 0.254: SV1.12 ~SYFLT1.TP 78.74,94.08 78.18,94.64 78.18,100.72 U$6.P$4
~SY_FLT2
  Top 0.254: ~SYFLT2.TP SV1.7
  Top 0.305: U$9.P$4 79.4,37.49 79.4,38.25 79.1,38.56 79.1,38.71 78.79,39.01 78.79,42.52 78.03,43.28 78.03,49.99 76.66,51.36 76.66,51.51 76.66,53.95 73.76,56.84 73.76,63.4 ~SYFLT2.TP

### Text on the board
tPlace: CAUTION: | FAIMS control system / (c) The Tech Toybox 2016,2017 | LETHAL VOLTAGES! / DO NOT TOUCH / OR ATTEMPT TO SERVICE